# Altium project niryoRpiAdapter.PrjPCB
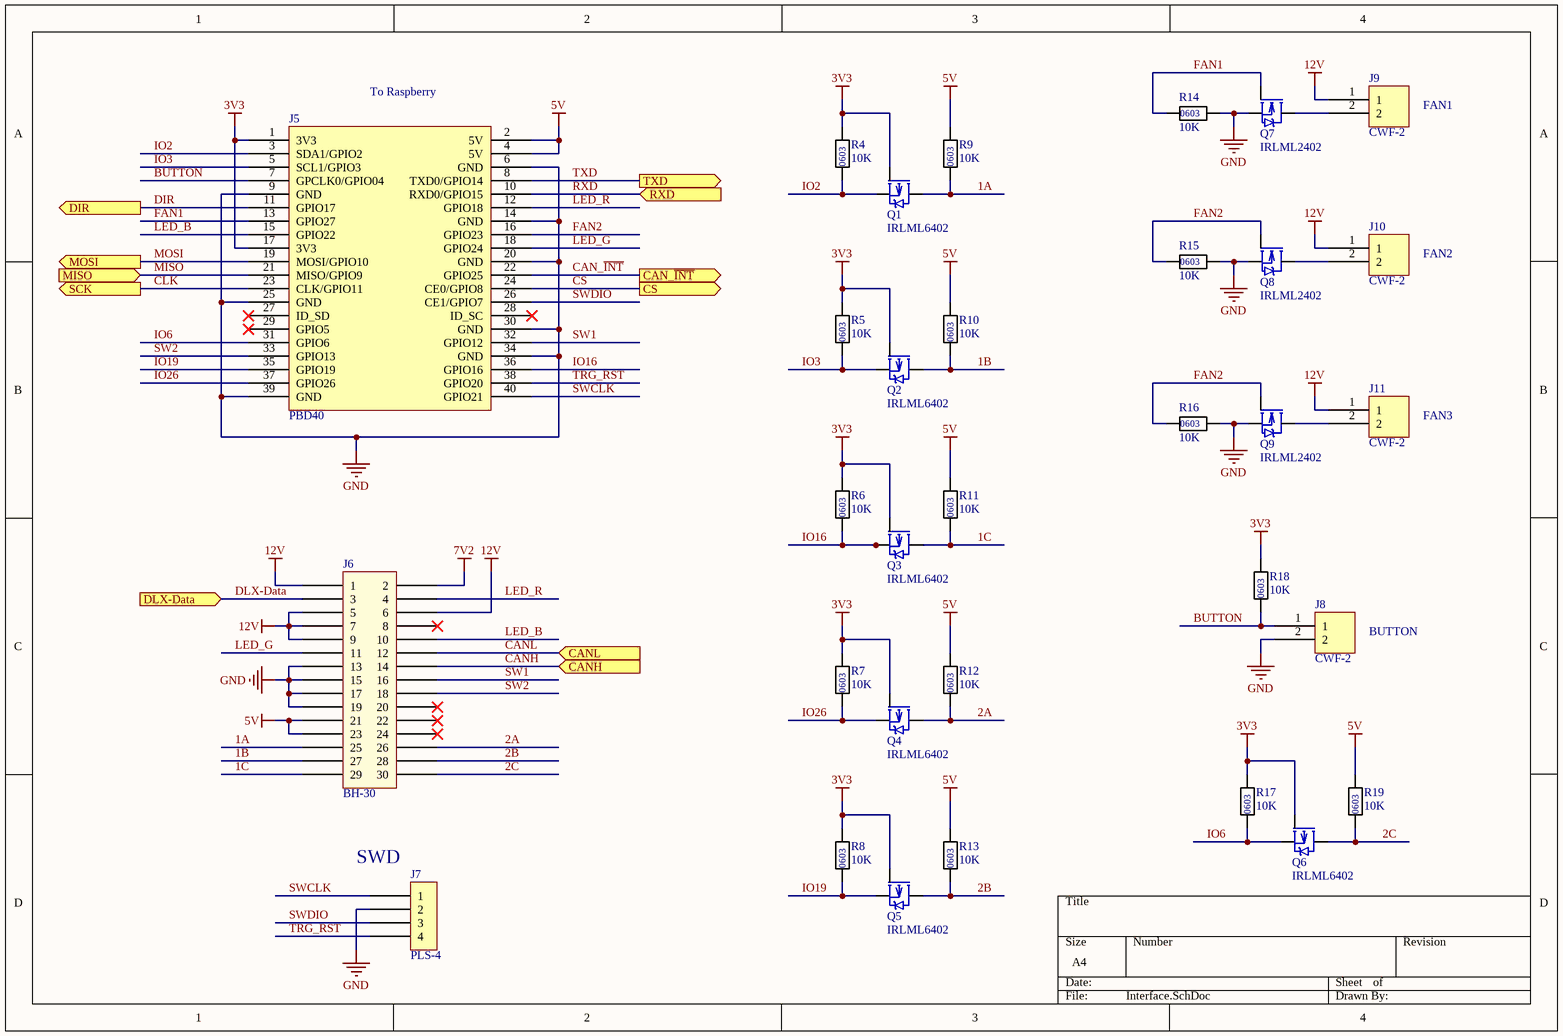
[diagram p0: Interface.SchDoc]
4 sheets, 85 parts. Net scope: flat (ports and power ports of the same name join across sheets).
Board file: RpiAdapterPCB.PcbDoc
Sheets:
  Interface.SchDoc
  CAN.SchDoc
  Dynamixel.SchDoc
  Power.SchDoc

## Sheet Interface.SchDoc
size A4

### Parts
J5  PBD40  [PLD40]
J6  BH-30  [BH-30]
J7  PLS-4  [PLS-4]
J8  CWF-2  [CWF-2]
J9  CWF-2  [CWF-2]
J10  CWF-2  [CWF-2]
J11  CWF-2  [CWF-2]
Q1  IRLML6402  [SOT23]
Q2  IRLML6402  [SOT23]
Q3  IRLML6402  [SOT23]
Q4  IRLML6402  [SOT23]
Q5  IRLML6402  [SOT23]
Q6  IRLML6402  [SOT23]
Q7  IRLML2402  [SOT23]
Q8  IRLML2402  [SOT23]
Q9  IRLML2402  [SOT23]
R4  10K  [CHIP_R_0603]
R5  10K  [CHIP_R_0603]
R6  10K  [CHIP_R_0603]
R7  10K  [CHIP_R_0603]
R8  10K  [CHIP_R_0603]
R9  10K  [CHIP_R_0603]
R10  10K  [CHIP_R_0603]
R11  10K  [CHIP_R_0603]
R12  10K  [CHIP_R_0603]
R13  10K  [CHIP_R_0603]
R14  10K  [CHIP_R_0603]
R15  10K  [CHIP_R_0603]
R16  10K  [CHIP_R_0603]
R17  10K  [CHIP_R_0603]
R18  10K  [CHIP_R_0603]
R19  10K  [CHIP_R_0603]

### Ports
CAN_~{INT} (out), CANH (in), CANL (in), CS (out), DIR (out), DLX-Data (in), MISO (in), MOSI (out), RXD (in), SCK (out), TXD (out)

### Nets
3V3: J5.1(3V3) J5.17(3V3) Q1.1(G) Q2.1(G) Q3.1(G) Q4.1(G) Q5.1(G) Q6.1(G) R4.2 R5.2 R6.2 R7.2 R8.2 R17.2 R18.2
5V: J5.2(5V) J5.4(5V) J6.21 J6.23 R9.2 R10.2 R11.2 R12.2 R13.2 R19.2
7V2: J6.2
12V: J6.1 J6.5 J6.6 J6.7 J6.9 J9.1 J10.1 J11.1
GND: J5.6(GND) J5.9(GND) J5.14(GND) J5.20(GND) J5.25(GND) J5.30(GND) J5.34(GND) J5.39(GND) J6.13 J6.15 J6.17 J6.19 J7.2 J8.2 Q7.2(S) Q8.2(S) Q9.2(S) R14.2 R15.2 R16.2
1A: J6.25 Q1.3(D) R9.1
1B: J6.27 Q2.3(D) R10.1
1C: J6.29 Q3.3(D) R11.1
2A: J6.26 Q4.3(D) R12.1
2B: J6.28 Q5.3(D) R13.1
2C: J6.30 Q6.3(D) R19.1
BUTTON: J5.7(GPCLK0/GPIO04) J8.1 R18.1
CAN_~{INT}: J5.22(GPIO25) ; port CAN_~{INT}
CANH: J6.14 ; port CANH
CANL: J6.12 ; port CANL
CLK: J5.23(CLK/GPIO11) ; port SCK
CS: J5.24(CE0/GPIO8) ; port CS  [project net CE]
DIR: J5.11(GPIO17) ; port DIR
DLX-Data: J6.3 ; port DLX-Data
FAN1: J5.13(GPIO27) Q7.1(G) R14.1
FAN2: J5.16(GPIO23) Q8.1(G) Q9.1(G) R15.1 R16.1
IO2: J5.3(SDA1/GPIO2) Q1.2(S) R4.1
IO3: J5.5(SCL1/GPIO3) Q2.2(S) R5.1
IO6: J5.31(GPIO6) Q6.2(S) R17.1
IO16: J5.36(GPIO16) Q3.2(S) R6.1
IO19: J5.35(GPIO19) Q5.2(S) R8.1
IO26: J5.37(GPIO26) Q4.2(S) R7.1
LED_B: J5.15(GPIO22) J6.10
LED_G: J5.18(GPIO24) J6.11
LED_R: J5.12(GPIO18) J6.4
MISO: J5.21(MISO/GPIO9) ; port MISO
MOSI: J5.19(MOSI/GPIO10) ; port MOSI
RXD: J5.10(RXD0/GPIO15) ; port RXD
SW1: J5.32(GPIO12) J6.16
SW2: J5.33(GPIO13) J6.18
SWCLK: J5.40(GPIO21) J7.1
SWDIO: J5.26(CE1/GPIO7) J7.3
TRG_RST: J5.38(GPIO20) J7.4
TXD: J5.8(TXD0/GPIO14) ; port TXD
NetJ9_2: J9.2 Q7.3(D)
NetJ10_2: J10.2 Q8.3(D)
NetJ11_2: J11.2 Q9.3(D)

Not connected (* = marked no-connect by the designer): J5 27(ID_SD)* 28(ID_SC)* 29(GPIO5)*; J6 8* 20* 22* 24*

### Notes on the sheet
- (near J5) To Raspberry
- FAN1
- FAN2
- FAN3
- BUTTON
- (near J7) SWD
- (in symbol RES_0603) 0603

### Library data of the parts
J5 = RPiGPIO
J8-J11 = CWF-2: Connector
Q1-Q6 = IRLML6402: p-chanal MOSFET
Q7-Q9 = IRLML2402: n-chanal MOSFET
R4-R19 = RES_0603

## Sheet CAN.SchDoc
size A4
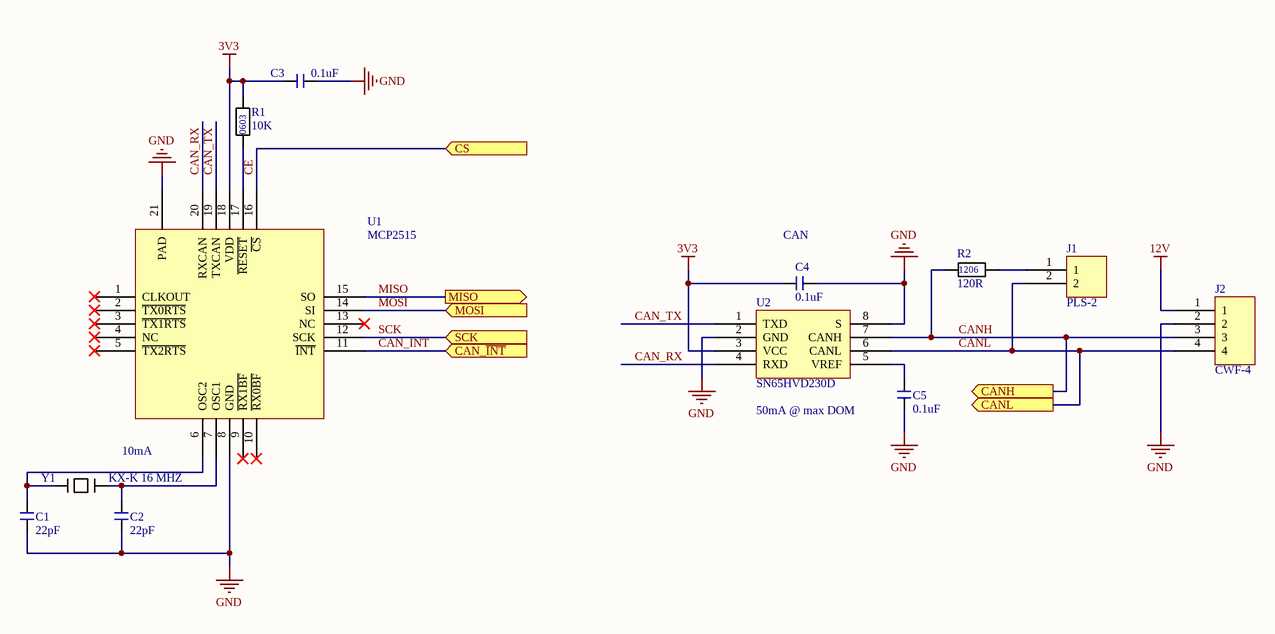
[diagram p1: CAN.SchDoc]

### Parts
C1  22pF  [CHIP_C_0603]
C2  22pF  [CHIP_C_0603]
C3  0.1uF  [CHIP_C_0603]
C4  0.1uF  [CHIP_C_0603]
C5  0.1uF  [CHIP_C_0603]
J1  PLS-2  [PLS-2]
J2  CWF-4  [CWF-4]
R1  10K  [CHIP_R_0603]
R2  120R  [CHIP_R_1206]
U1  MCP2515  [QFN20]
U2  SN65HVD230D  [SOIC8]
Y1  KX-K 16 MHZ  [CHIP_CRYSTAL_5032]

### Ports
CAN_~{INT} (in), CANH (out), CANL (out), CS (in), MISO (out), MOSI (in), SCK (in)

### Nets
3V3: C3.2 C4.2 R1.2 U1.18(VDD) U2.3(VCC)
12V: J2.1
GND: C1.1 C2.1 C3.1 C4.1 C5.1 J2.2 U1.8(GND) U1.21(PAD) U2.2(GND) U2.8(S)
CAN_~{INT}: U1.11(~{INT}) ; port CAN_~{INT}
CAN_RX: U1.20(RXCAN) U2.4(RXD)
CAN_TX: U1.19(TXCAN) U2.1(TXD)
CANH: J2.3 R2.1 U2.7(CANH) ; port CANH
CANL: J1.2 J2.4 U2.6(CANL) ; port CANL
CE: U1.16(~{CS}) ; port CS
MISO: U1.15(SO) ; port MISO
MOSI: U1.14(SI) ; port MOSI
SCK: U1.12(SCK) ; port SCK  [project net CLK]
NetC1_2: C1.2 U1.6(OSC2) Y1.1
NetC2_2: C2.2 U1.7(OSC1) Y1.2
NetC5_2: C5.2 U2.5(VREF)
NetJ1_1: J1.1 R2.2
NetR1_1: R1.1 U1.17(~{RESET})

Not connected (* = marked no-connect by the designer): U1 1(CLKOUT)* 2(~{TX0RTS})* 3(~{TX1RTS})* 4(NC)* 5(~{TX2RTS})* 9(~{RX1BF})* 10(~{RX0BF})* 13(NC)*

### Notes on the sheet
- (near C4) CAN
- 10mA
- 50mA @ max DOM
- (in symbol RES_0603) 0603
- (in symbol RES_1206) 1206

### Library data of the parts
C1-C5 = CHIP_C
J1 = PLS-2: Connector
R1 = RES_0603
R2 = RES_1206
U1 = MCP2515_QFN
U2 = TJA1050
Y1 = Quartz

## Sheet Dynamixel.SchDoc
size A4
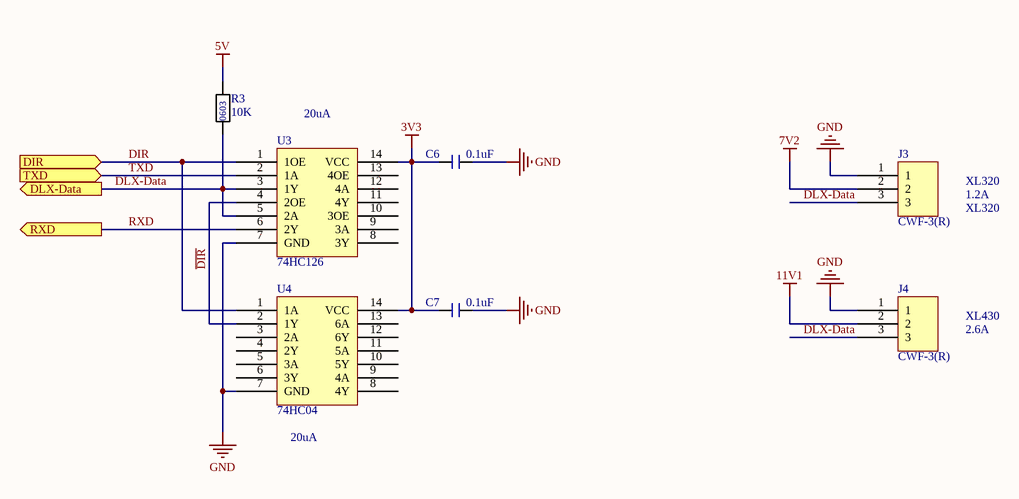
[diagram p2: Dynamixel.SchDoc]

### Parts
C6  0.1uF  [CHIP_C_0603]
C7  0.1uF  [CHIP_C_0603]
J3  CWF-3(R)  [DS1066-03]
J4  CWF-3(R)  [CWF-3]
R3  10K  [CHIP_R_0603]
U3  74HC126  [SOIC14]
U4  74HC04  [SOIC14]

### Ports
DIR (in), DLX-Data (out), RXD (out), TXD (in)

### Nets
3V3: C6.2 C7.2 U3.14(VCC) U4.14(VCC)
5V: R3.2
7V2: J3.2
11V1: J4.2
GND: C6.1 C7.1 J3.1 J4.1 U3.7(GND) U4.7(GND)
~{DIR}: U3.4(2OE) U4.2(1Y)
DIR: U3.1(1OE) U4.1(1A) ; port DIR
DLX-Data: J3.3 J4.3 R3.1 U3.3(1Y) U3.5(2A) ; port DLX-Data
RXD: U3.6(2Y) ; port RXD
TXD: U3.2(1A) ; port TXD

Not connected (* = marked no-connect by the designer): U3 8(3Y) 9(3A) 10(3OE) 11(4Y) 12(4A) 13(4OE); U4 3(2A) 4(2Y) 5(3A) 6(3Y) 8(4Y) 9(4A) 10(5Y) 11(5A) 12(6Y) 13(6A)

### Notes on the sheet
- (near U3) 20uA
- XL320
- 1.2A
- XL430
- 2.6A
- (near U4) 20uA
- (in symbol RES_0603) 0603

### Library data of the parts
C6 C7 = CHIP_C
J3 J4 = CWF-3(R): Conector
R3 = RES_0603

## Sheet Power.SchDoc
size A4
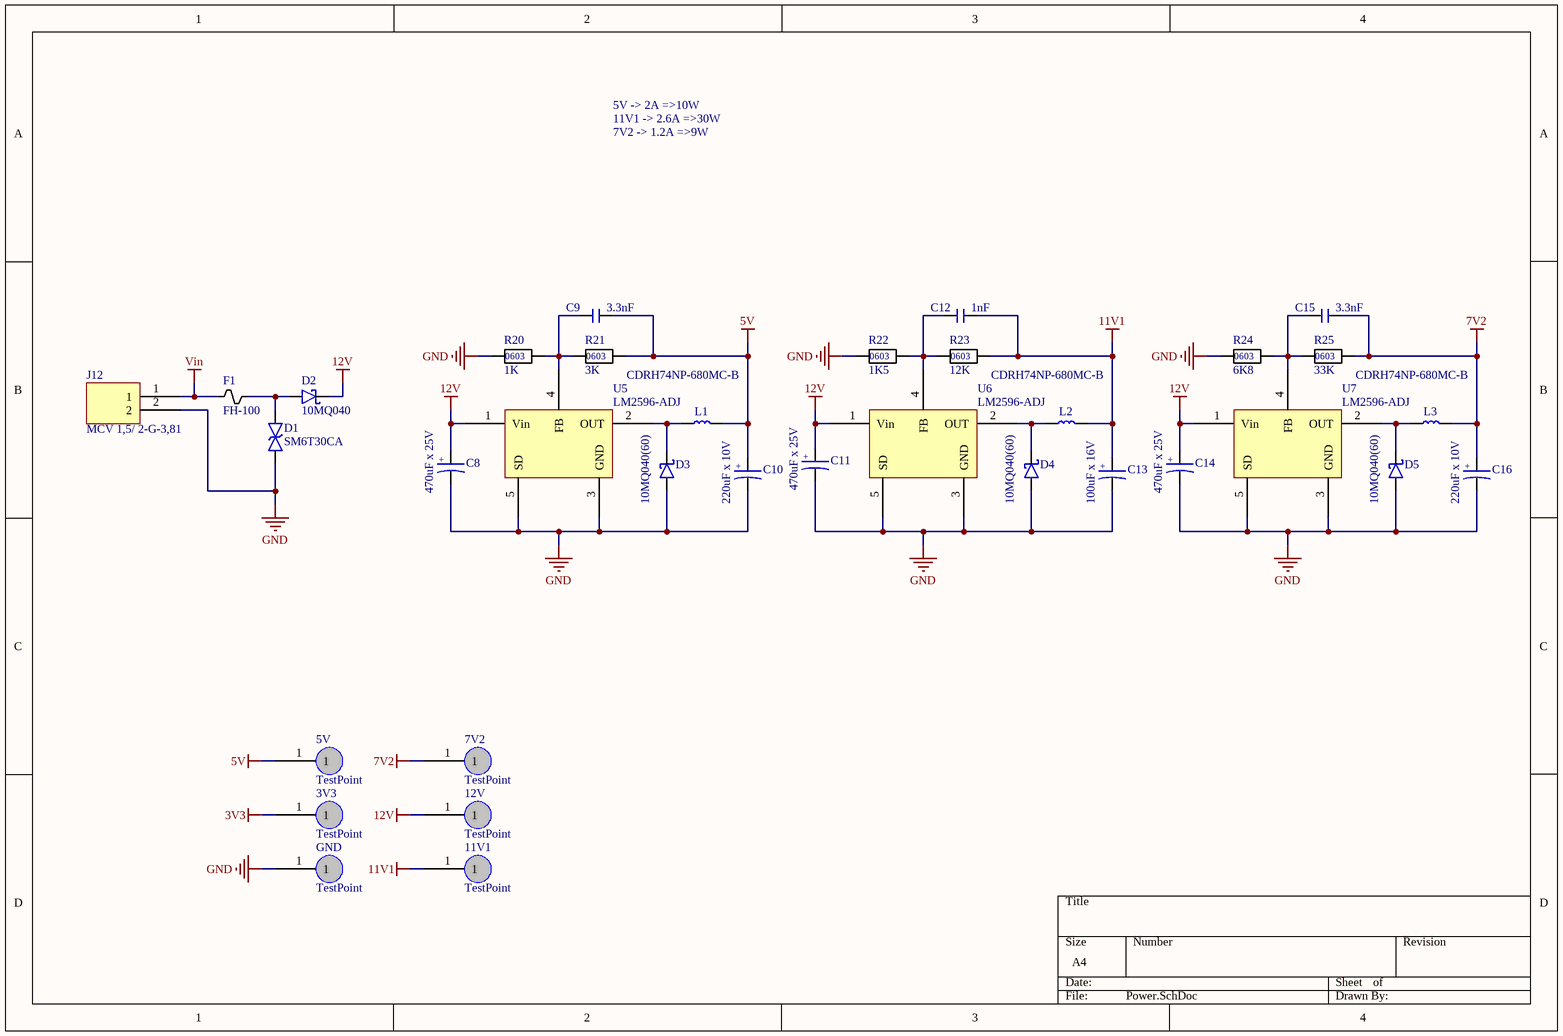
[diagram p3: Power.SchDoc]

### Parts
3V3  TestPoint  [TestPoint]
5V  TestPoint  [TestPoint]
7V2  TestPoint  [TestPoint]
11V1  TestPoint  [TestPoint]
12V  TestPoint  [TestPoint]
C8  470uF x 25V  [ALCAP_8x16]
C9  3.3nF  [CHIP_C_0603]
C10  220uF x 10V  [Tantal - D]
C11  470uF x 25V  [ALCAP_8x16]
C12  1nF  [CHIP_C_0603]
C13  100uF x 16V  [Tantal - B]
C14  470uF x 25V  [ALCAP_8x16]
C15  3.3nF  [CHIP_C_0603]
C16  220uF x 10V  [Tantal - D]
D1  SM6T30CA  [DO-214AA]
D2  10MQ040  [DO214-AC]
D3  10MQ040(60)  [DO214-AC]
D4  10MQ040(60)  [DO214-AC]
D5  10MQ040(60)  [DO214-AC]
F1  FH-100  [FH-100]
GND  TestPoint  [TestPoint]
J12  MCV 1,5/ 2-G-3,81  [CON_2_5.08]
L1  CDRH74NP-680MC-B  [CDRH74]
L2  CDRH74NP-680MC-B  [CDRH74]
L3  CDRH74NP-680MC-B  [CDRH74]
R20  1K  [CHIP_R_0603]
R21  3K  [CHIP_R_0603]
R22  1K5  [CHIP_R_0603]
R23  12K  [CHIP_R_0603]
R24  6K8  [CHIP_R_0603]
R25  33K  [CHIP_R_0603]
U5  LM2596-ADJ  [TO-220-5]
U6  LM2596-ADJ  [TO-220-5]
U7  LM2596-ADJ  [TO-220-5]

### Nets
3V3: 3V3.1
5V: 5V.1 C9.1 C10.1 L1.2 R21.2
7V2: 7V2.1 C15.1 C16.1 L3.2 R25.2
11V1: 11V1.1 C12.1 C13.1 L2.2 R23.2
12V: 12V.1 C8.1 C11.1 C14.1 D2.2 U5.1(Vin) U6.1(Vin) U7.1(Vin)
GND: C8.2 C10.2 C11.2 C13.2 C14.2 C16.2 D1.2 D3.1 D4.1 D5.1 GND.1 J12.2 R20.1 R22.1 R24.1 U5.3(GND) U5.5(SD) U6.3(GND) U6.5(SD) U7.3(GND) U7.5(SD)
Vin: F1.1 J12.1
NetC9_2: C9.2 R20.2 R21.1 U5.4(FB)
NetC12_2: C12.2 R22.2 R23.1 U6.4(FB)
NetC15_2: C15.2 R24.2 R25.1 U7.4(FB)
NetD1_1: D1.1 D2.1 F1.2
NetD3_2: D3.2 L1.1 U5.2(OUT)
NetD4_2: D4.2 L2.1 U6.2(OUT)
NetD5_2: D5.2 L3.1 U7.2(OUT)

### Notes on the sheet
- 5V -> 2A =>10W
- 11V1 -> 2.6A =>30W
- 7V2 -> 1.2A =>9W
- (in symbol Electrolit) +
- (in symbol RES_0603) 0603
- (in symbol Tantal) +

### Library data of the parts
C8 C11 C14 = Electrolit
C9 C12 C15 = CHIP_C
C10 C13 C16 = Tantal
D1 = SM6T27CA: ESD protection
D2-D5 = 10MQ040: Rectifier diode
F1 = FuseGlass 5x20
L1-L3 = CDRH74
R20-R25 = RES_0603
U5-U7 = LM2596 (5 pin)

## Nets that join several sheets
3V3: Interface (15 pins), CAN (5 pins), Dynamixel (C6.2 C7.2 U3.14 U4.14), Power (3V3.1)
5V: Interface (10 pins), Dynamixel (R3.2), Power (5 pins)
7V2: Interface (J6.2), Dynamixel (J3.2), Power (5 pins)
11V1: Dynamixel (J4.2), Power (5 pins)
12V: Interface (8 pins), CAN (J2.1), Power (8 pins)
GND: Interface (20 pins), CAN (10 pins), Dynamixel (6 pins), Power (21 pins)
CAN_~{INT}: Interface (J5.22), CAN (U1.11)
CANH: Interface (J6.14), CAN (J2.3 R2.1 U2.7)
CANL: Interface (J6.12), CAN (J1.2 J2.4 U2.6)
CE: Interface (J5.24), CAN (U1.16)
CLK: Interface (J5.23), CAN (U1.12)
DIR: Interface (J5.11), Dynamixel (U3.1 U4.1)
DLX-Data: Interface (J6.3), Dynamixel (5 pins)
MISO: Interface (J5.21), CAN (U1.15)
MOSI: Interface (J5.19), CAN (U1.14)
RXD: Interface (J5.10), Dynamixel (U3.6)
TXD: Interface (J5.8), Dynamixel (U3.2)